# Altium schematic sheet REVERSE_PROTECTION.SchDoc
size A3; SheetNumber: 7; SheetTotal: 16
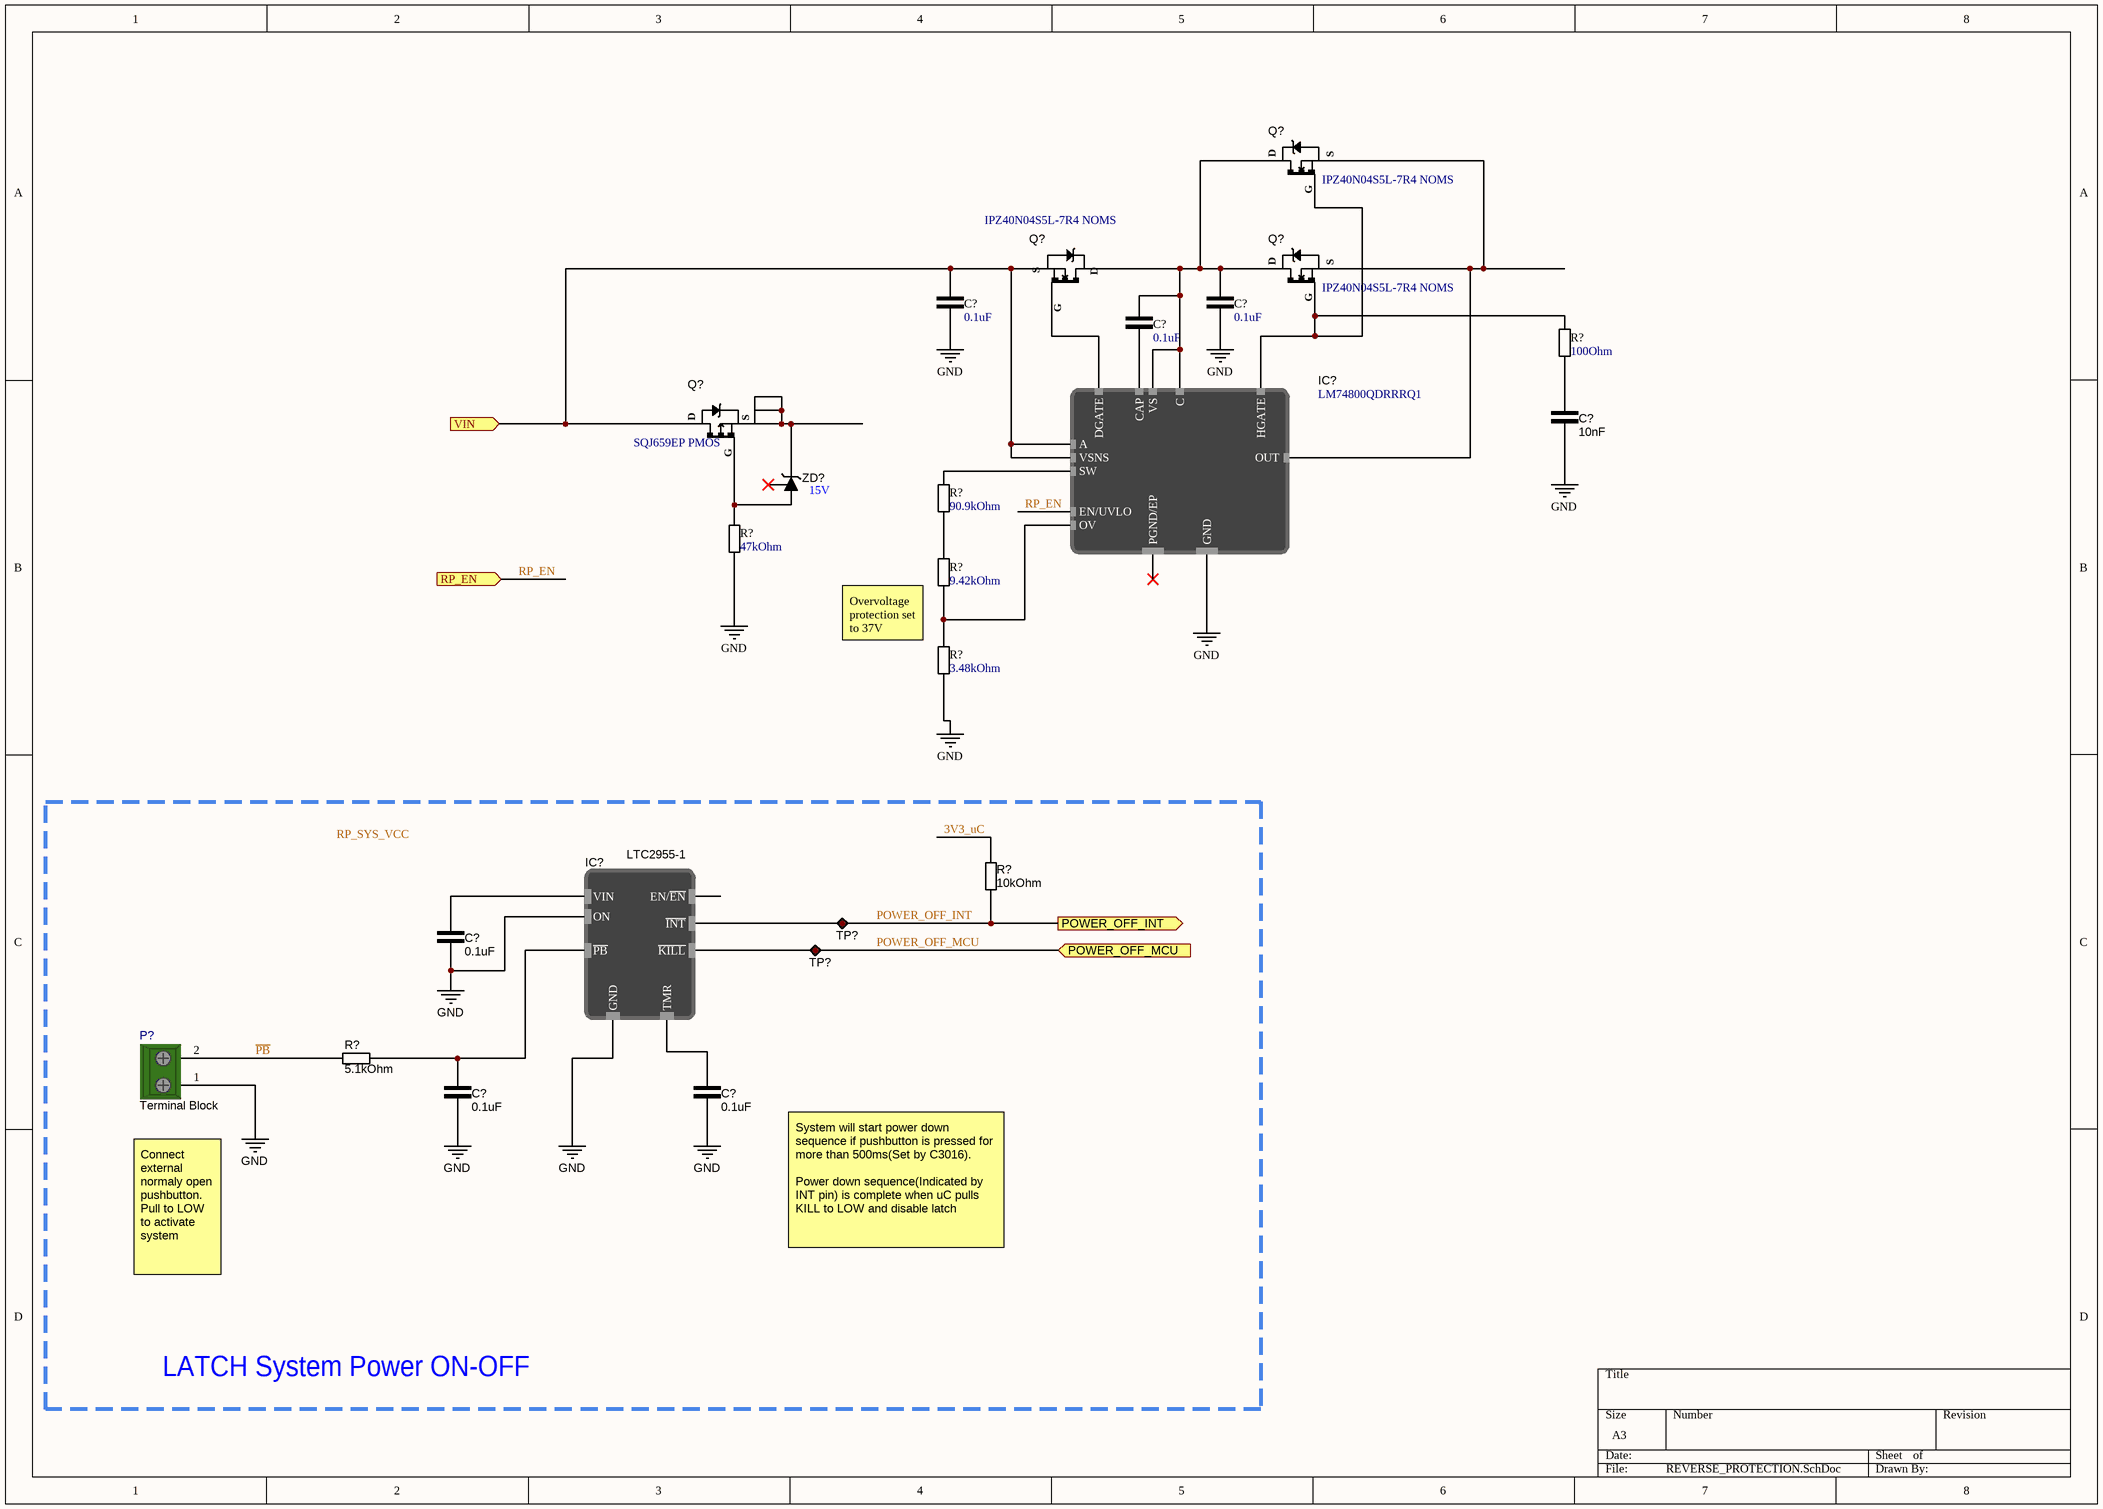
[diagram p0: REVERSE_PROTECTION.SchDoc]

## Parts
(Parts that share a designator on the sheet are numbered #1, #2 ... from top to bottom, then left to right.)
C?#1  0.1uF  [CAP_0603]
C?#2  0.1uF  [CAP_0603]
C?#3  0.1uF  [CAP_0603]
C?#4  10nF  [CAP_0603]
C?#5  0.1uF  [CAP_0603]
C?#6  0.1uF  [CAP_0603]
C?#7  0.1uF  [CAP_0603]
IC?#1  LM74800QDRRRQ1  [SON50P300X80_HS-13N]
IC?#2  LTC2955-1  [TSOP65P280X100-8N]
P?  Terminal Block  [TERM_BLOCK 5mm 2PIN]
Q?#1  IPZ40N04S5L-7R4 NOMS  [PG-TSDSON-8-32]
Q?#2  IPZ40N04S5L-7R4 NOMS  [PG-TSDSON-8-32]
Q?#3  IPZ40N04S5L-7R4 NOMS  [PG-TSDSON-8-32]
Q?#4  SQJ659EP PMOS  [PowerPAK SO-8L SINGLE]
R?#1  100Ohm  [RES_0603]
R?#2  90.9kOhm  [RES_0603]
R?#3  47kOhm  [RES_0603]
R?#4  9.42kOhm  [RES_0603]
R?#5  3.48kOhm  [RES_0603]
R?#6  10kOhm  [RES_0603]
R?#7  5.1kOhm  [RES_0603]
TP?#1  Test point  [TestPoint]  (value not drawn)
TP?#2  Test point  [TestPoint]  (value not drawn)
ZD?  DZ23C15-E3-08 Zener Diode  [SOT95P245X96-3N]  (value not drawn)

## Ports
POWER_OFF_INT (out), POWER_OFF_MCU (in), RP_EN (in), VIN (in)

## Nets
GND: C?#1.1 C?#2.1 C?#4.1 C?#5.1 C?#6.1 C?#7.1 IC?#1.7(GND) IC?#2.1(ON) IC?#2.4(GND) P?.1(pin1) R?#3.1 R?#5.1
3V3_uC: R?#6.2
~{PB}: P?.2(pin2) R?#7.1
POWER_OFF_INT: IC?#2.8(~{INT}) R?#6.1 TP?#1.1 ; port POWER_OFF_INT
POWER_OFF_MCU: IC?#2.2(~{KILL}) TP?#2.1 ; port POWER_OFF_MCU
RP_EN: IC?#1.6(EN/UVLO) ; port RP_EN
VIN: C?#1.2 IC?#1.2(A) IC?#1.3(VSNS) Q?#2.S(Source) Q?#4.D ; port VIN
NetC?#2_2: C?#2.2 C?#3.2 IC?#1.10(VS) IC?#1.12(C) Q?#1.D(Drain) Q?#2.D(Drain) Q?#3.D(Drain)
NetC?#3_1: C?#3.1 IC?#1.11(CAP)
NetC?#4_2: C?#4.2 R?#1.1
NetC?#5_2: C?#5.2 IC?#2.6(VIN)
NetC?#6_2: C?#6.2 IC?#2.5(~{PB}) R?#7.2
NetC?#7_2: C?#7.2 IC?#2.3(TMR)
NetIC?#1_1: IC?#1.1(DGATE) Q?#2.G(Gate)
NetIC?#1_4: IC?#1.4(SW) R?#2.2
NetIC?#1_5: IC?#1.5(OV) R?#4.1 R?#5.2
NetIC?#1_8: IC?#1.8(HGATE) Q?#1.G(Gate) Q?#3.G(Gate) R?#1.2
NetIC?#1_9: IC?#1.9(OUT) Q?#1.S(Source) Q?#3.S(Source)
NetQ?#4_G: Q?#4.G R?#3.2 ZD?.1(Anode)
NetQ?#4_S: Q?#4.S(S1) ZD?.3(Cathode)
NetR?#2_1: R?#2.1 R?#4.2

Not connected (* = marked no-connect by the designer): IC?#1 13(PGND/EP)*; IC?#2 7(EN/~{EN}); ZD? 2(Anode)*

## Notes on the sheet
- (near ZD?) 15V
- (near R?#4) Overvoltage protection set to 37V
- System will start power down sequence if pushbutton is pressed for more than 500ms(Set by C3016).
  Power down sequence(Indicated by INT pin) is complete when uC pulls KILL to LOW and disable latch
- Connect external normaly open pushbutton.
  Pull to LOW to activate system
- LATCH System Power ON-OFF
- Labels drawn without touching a wire or pin: RP_SYS_VCC

## Library data of the parts
C?#1-C?#3 C?#5-C?#7 = C000018: 0.1 µF ±10% 50V Ceramic Capacitor X7R 0603 (1608 Metric); ComponentLink1Description: DigiKey; ComponentLink1URL: https://www.digikey.com/en/products/detail/samsung-electro-mechanics/CL10B104KB8NNNC/3886658; DigiKey Part Number: 1276-1000-1-ND; capacitance: 0.1uF
C?#4 = C000034: 10000 pF ±10% 50V Ceramic Capacitor X7R 0603 (1608 Metric); ComponentLink1Description: DigiKey; ComponentLink1URL: https://www.digikey.com/en/products/detail/kemet/C0603C103K5RACTU/411090; DigiKey Part Number: 399-C0603C103K5RACTUCT-ND; capacitance: 10nF
IC?#1 = LM74800QDRRRQ1: OR Controller N+1 ORing Controller N-Channel 1:1 12-WSON (3x3); DigiKey Part Number: 296-LM74800QDRRRQ1CT-ND; ComponentLink1Description: DigiKey; ComponentLink1URL: https://www.digikey.com/en/products/detail/texas-instruments/LM74800QDRRRQ1/13627158; Mouser Part Number: 595-LM74800QDRRRQ1; ComponentLink2Description: Mouser; ComponentLink2URL: https://eu.mouser.com/ProductDetail/Texas-Instruments/LM74800QDRRRQ1?qs=KUoIvG%2F9IlYNgS7D9vQjYA%3D%3D
IC?#2 = LTC2955-1: Power Supply Controller Push Button, On/Off Controller TSOT-23-8; DigiKey Part Number: 505-LTC2955CTS8-1#TRMPBFCT-ND; ComponentLink1Description: DigiKey; ComponentLink1URL: https://www.digikey.com/en/products/detail/analog-devices-inc/LTC2955CTS8-1-TRMPBF/3065178; Mouser Part Number: 584-C2955CTS8-1TMPF; ComponentLink2Description: Mouser; ComponentLink2URL: https://eu.mouser.com/ProductDetail/Analog-Devices/LTC2955CTS8-1TRMPBF?qs=hVkxg5c3xu%252B6Fq1Ir3bkGg%3D%3D
P? = 00000001: Terminal block 90 deg 5mm 2PIN; ComponentLink1Description: DigiKey; ComponentLink1URL: https://www.digikey.com/en/products/detail/adam-tech/EB20-02-C/9831508; DigiKey part number: 2057-EB20-02-C-ND
Q?#1-Q?#3 = 00000007: N-Channel 40 V 40A (Tc) 34W (Tc) Surface Mount PG-TSDSON-8; DigiKey Part Number: IPZ40N04S5L7R4ATMA1CT-ND; Mouser Part Number: 726-IPZ40N04S5L7R4AT; ComponentLink1Description: DigiKey; ComponentLink1URL: https://www.digikey.com/en/products/detail/infineon-technologies/IPZ40N04S5L7R4ATMA1/5960382; ComponentLink2Description: Mouser; ComponentLink2URL: https://eu.mouser.com/ProductDetail/Infineon-Technologies/IPZ40N04S5L7R4ATMA1?qs=RJIhqtkBntMJfptUOROQRQ%3D%3D; ComponentLink3Description: Footprint Drawing; ComponentLink3URL: https://www.infineon.com/cms/en/product/packages/PG-TSDSON/PG-TSDSON-8-32/#!downloads
Q?#4 = 00000005: P-Channel 60 V 52A (Tc) 83W (Tc) Surface Mount PowerPAK® SO-8; DigiKey Part Number: SQJ459EP-T1_GE3CT-ND; Mouser Part Number: 78-SQJ459EP-T2_BE3; ComponentLink1Description: DigiKey; ComponentLink1URL: https://www.digikey.com/en/products/detail/vishay-siliconix/SQJ459EP-T1-GE3/6708881; ComponentLink2Description: Mouser; ComponentLink2URL: https://eu.mouser.com/ProductDetail/Vishay-Siliconix/SQJ459EP-T2_BE3?qs=CiayqK2gdcKpg8h0vLRPjA%3D%3D
R?#1 = R000030: 100 Ohms ±1% 0.1W, 1/10W Chip Resistor 0603 (1608 Metric) Moisture Resistant Thick Film; ComponentLink1Description: DigiKey; ComponentLink1URL: https://www.digikey.com/en/products/detail/yageo/RC0603FR-07100RL/726888; resistance: 100Ohm; DigiKey Part Number: 311-100HRCT-ND
R?#2 = R000027: 90.9 kOhms ±1% 0.1W, 1/10W Chip Resistor 0603 (1608 Metric) Automotive AEC-Q200 Thick Film; ComponentLink1Description: DigiKey; ComponentLink1URL: https://www.digikey.com/en/products/detail/panasonic-electronic-components/ERJ-3EKF9092V/196512; resistance: 90.9kOhm; DigiKey Part Number: P90.9KHCT-ND
R?#3 = R000010: 47 kOhms ±1% 0.1W, 1/10W Chip Resistor 0603 (1608 Metric) Moisture Resistant Thick Film; ComponentLink1Description: DigiKey; ComponentLink1URL: https://www.digikey.com/en/products/detail/yageo/RC0603FR-0747KL/727253; resistance: 47kOhm; DigiKey Part Number: 311-47.0KHRCT-ND
R?#4 = R000028: 9.42 kOhms ±1% 0.1W, 1/10W Chip Resistor 0603 (1608 Metric) Automotive AEC-Q200, Moisture Resistant Metal Film; ComponentLink1Description: DigiKey; ComponentLink1URL: https://www.digikey.com/en/products/detail/koa-speer-electronics-inc/RN73H1JTTD9421F25/10688584?s=N4IgjCBcoMxaBjKAzAhgGwM4FMA0IB7KAbXDBggF18AHAFyhAGU6AnASwDsBzEAX3xgAbPBBJIaLHkIkQMAJwAmACwjqIeoxYce-fIoAMADgCso8ZJz4ikUvIB0yxQAIA1gHkAFgFtMIdZqQIACqnOx07sgAstiomACurNh6IAC0iuZQbPHSNqRmlHwCIBm2IEmY7Jh0BKz%2BfEA; resistance: 9.42kOhm; DigiKey Part Number: 2019-RN73H1JTTD9421F25CT-ND
R?#5 = R000029: 3.48 kOhms ±1% 0.1W, 1/10W Chip Resistor 0603 (1608 Metric) Automotive AEC-Q200 Thick Film; ComponentLink1Description: DigiKey; ComponentLink1URL: https://www.digikey.com/en/products/detail/stackpole-electronics-inc/RMCF0603FT3K48/1761028; resistance: 3.48kOhm; DigiKey Part Number: RMCF0603FT3K48CT-ND
R?#6 = R000001: 10 kOhms ±1% 0.125W, 1/8W Chip Resistor 0603 (1608 Metric) Anti-Sulfur Thin Film; resistance: 10kOhm; ComponentLink1Description: DigiKey; ComponentLink1URL: https://www.digikey.com/en/products/detail/vishay-beyschlag-draloric-bc-components/MCT06030C1002FP500/1850440; DigiKey Part Number: MCT0603-10.0K-CFCT-ND
R?#7 = R000013: 5.1 kOhms ±1% 0.1W, 1/10W Chip Resistor 0603 (1608 Metric) Moisture Resistant Thick Film; ComponentLink1Description: DigiKey; ComponentLink1URL: https://www.digikey.com/en/products/detail/yageo/RC0603FR-075K1L/727268; resistance: 5.1kOhm; DigiKey Part Number: 311-5.10KHRCT-ND
TP?#1 TP?#2 = TP002: Test point 1mm
ZD? = 00000006: Zener Diode Array 1 Pair Common Cathode 15 V 300 mW ±5% SOT-23-3; DigiKey Part Number: 112-DZ23C15-E3-08CT-ND; ComponentLink1Description: DigiKey; ComponentLink1URL: https://www.digikey.com/en/products/detail/vishay-general-semiconductor-diodes-division/DZ23C15-E3-08/4831460